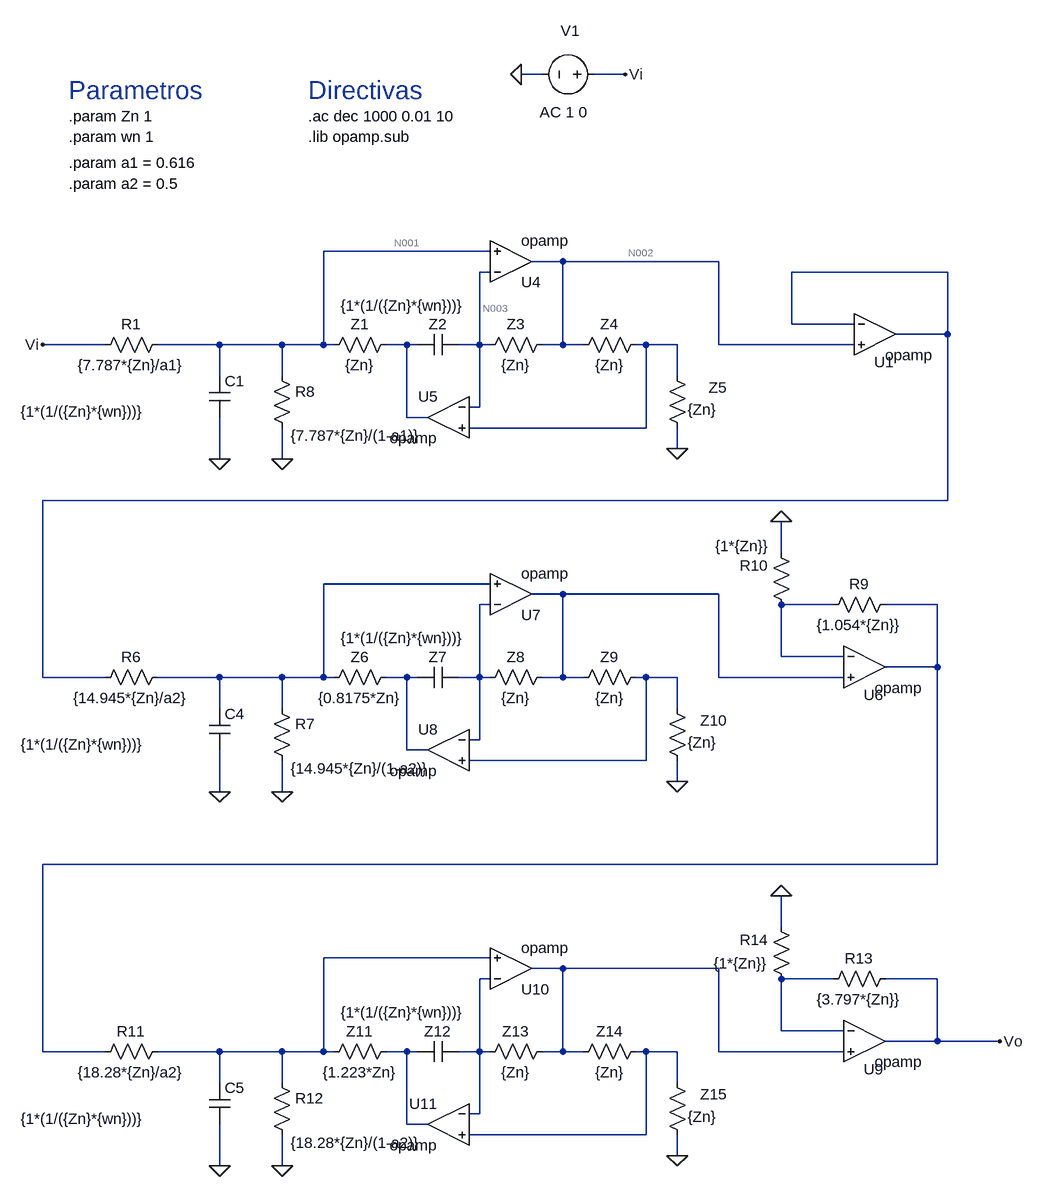
[diagram p0: schematic Circuito_GIC.asc]
Circuito_GIC.asc, the LTspice schematic file:
Version 4
SHEET 1 3280 1412
WIRE -368 -288 -400 -288
WIRE -240 -288 -288 -288
WIRE -448 -16 -704 -16
WIRE -336 0 -384 0
WIRE -96 0 -336 0
WIRE -448 16 -464 16
WIRE 256 16 16 16
WIRE 16 96 16 16
WIRE 112 96 16 96
WIRE 256 112 256 16
WIRE 256 112 176 112
WIRE -1040 128 -1136 128
WIRE -864 128 -960 128
WIRE -768 128 -864 128
WIRE -704 128 -704 -16
WIRE -704 128 -768 128
WIRE -688 128 -704 128
WIRE -576 128 -608 128
WIRE -560 128 -576 128
WIRE -464 128 -464 16
WIRE -464 128 -496 128
WIRE -448 128 -464 128
WIRE -336 128 -336 0
WIRE -336 128 -368 128
WIRE -304 128 -336 128
WIRE -208 128 -224 128
WIRE -160 128 -208 128
WIRE -96 128 -96 0
WIRE 112 128 -96 128
WIRE -864 176 -864 128
WIRE -768 176 -768 128
WIRE -160 176 -160 128
WIRE -464 224 -464 128
WIRE -464 224 -480 224
WIRE -576 240 -576 128
WIRE -544 240 -576 240
WIRE -208 256 -208 128
WIRE -208 256 -480 256
WIRE -160 288 -160 256
WIRE -864 304 -864 240
WIRE -768 304 -768 256
WIRE 256 368 256 112
WIRE 256 368 -1136 368
WIRE 0 448 0 400
WIRE -448 496 -704 496
WIRE -336 512 -384 512
WIRE -96 512 -336 512
WIRE -448 528 -464 528
WIRE 80 528 0 528
WIRE 240 528 160 528
WIRE 0 608 0 528
WIRE 96 608 0 608
WIRE 240 624 240 528
WIRE 240 624 160 624
WIRE -1136 640 -1136 368
WIRE -1040 640 -1136 640
WIRE -864 640 -960 640
WIRE -768 640 -864 640
WIRE -704 640 -704 496
WIRE -704 640 -768 640
WIRE -688 640 -704 640
WIRE -576 640 -608 640
WIRE -560 640 -576 640
WIRE -464 640 -464 528
WIRE -464 640 -496 640
WIRE -448 640 -464 640
WIRE -336 640 -336 512
WIRE -336 640 -368 640
WIRE -304 640 -336 640
WIRE -208 640 -224 640
WIRE -160 640 -208 640
WIRE -96 640 -96 512
WIRE 96 640 -96 640
WIRE -864 688 -864 640
WIRE -768 688 -768 640
WIRE -160 688 -160 640
WIRE -464 736 -464 640
WIRE -464 736 -480 736
WIRE -576 752 -576 640
WIRE -544 752 -576 752
WIRE -208 768 -208 640
WIRE -208 768 -480 768
WIRE -160 800 -160 768
WIRE -864 816 -864 752
WIRE -768 816 -768 768
WIRE 240 928 240 624
WIRE 240 928 -1136 928
WIRE 0 1024 0 976
WIRE -448 1072 -704 1072
WIRE -336 1088 -384 1088
WIRE -96 1088 -336 1088
WIRE -448 1104 -464 1104
WIRE 80 1104 0 1104
WIRE 240 1104 160 1104
WIRE 0 1184 0 1104
WIRE 96 1184 0 1184
WIRE 240 1200 240 1104
WIRE 240 1200 160 1200
WIRE 336 1200 240 1200
WIRE -1136 1216 -1136 928
WIRE -1040 1216 -1136 1216
WIRE -864 1216 -960 1216
WIRE -768 1216 -864 1216
WIRE -704 1216 -704 1072
WIRE -704 1216 -768 1216
WIRE -688 1216 -704 1216
WIRE -576 1216 -608 1216
WIRE -560 1216 -576 1216
WIRE -464 1216 -464 1104
WIRE -464 1216 -496 1216
WIRE -448 1216 -464 1216
WIRE -336 1216 -336 1088
WIRE -336 1216 -368 1216
WIRE -304 1216 -336 1216
WIRE -208 1216 -224 1216
WIRE -160 1216 -208 1216
WIRE -96 1216 -96 1088
WIRE 96 1216 -96 1216
WIRE -864 1264 -864 1216
WIRE -768 1264 -768 1216
WIRE -160 1264 -160 1216
WIRE -464 1312 -464 1216
WIRE -464 1312 -480 1312
WIRE -576 1328 -576 1216
WIRE -544 1328 -576 1328
WIRE -208 1344 -208 1216
WIRE -208 1344 -480 1344
WIRE -160 1376 -160 1344
WIRE -864 1392 -864 1328
WIRE -768 1392 -768 1344
FLAG -864 304 0
FLAG -1136 128 Vi
FLAG -240 -288 Vi
FLAG -400 -288 0
FLAG 336 1200 Vo
FLAG -160 288 0
FLAG -768 304 0
FLAG -864 816 0
FLAG -160 800 0
FLAG -768 816 0
FLAG 0 400 0
FLAG -864 1392 0
FLAG -160 1376 0
FLAG -768 1392 0
FLAG 0 976 0
SYMBOL OpAmps\\opamp 144 48 R0
WINDOW 0 -1 107 Left 2
SYMATTR InstName U1
SYMBOL res -944 112 R90
WINDOW 0 0 56 VBottom 2
WINDOW 3 32 56 VTop 2
SYMATTR InstName R1
SYMATTR Value {7.787*{Zn}/a1}
SYMBOL cap -880 176 R0
WINDOW 3 -290 55 Left 2
SYMATTR Value {1*(1/({Zn}*{wn}))}
SYMATTR InstName C1
SYMBOL voltage -272 -288 R90
WINDOW 123 58 26 VRight 2
WINDOW 39 0 0 Left 0
WINDOW 0 -67 38 VRight 2
SYMATTR Value2 AC 1 0
SYMATTR InstName V1
SYMATTR Value ""
SYMBOL res -592 112 R90
WINDOW 0 0 56 VBottom 2
WINDOW 3 32 56 VTop 2
SYMATTR InstName Z1
SYMATTR Value {Zn}
SYMBOL cap -496 112 R90
WINDOW 0 0 32 VBottom 2
WINDOW 3 -60 85 VTop 2
SYMATTR InstName Z2
SYMATTR Value {1*(1/({Zn}*{wn}))}
SYMBOL res -352 112 R90
WINDOW 0 0 56 VBottom 2
WINDOW 3 32 56 VTop 2
SYMATTR InstName Z3
SYMATTR Value {Zn}
SYMBOL res -208 112 R90
WINDOW 0 0 56 VBottom 2
WINDOW 3 32 56 VTop 2
SYMATTR InstName Z4
SYMATTR Value {Zn}
SYMBOL res -144 272 R180
WINDOW 0 -61 78 Left 2
WINDOW 3 -45 44 Left 2
SYMATTR InstName Z5
SYMATTR Value {Zn}
SYMBOL OpAmps\\opamp -416 64 M180
SYMATTR InstName U4
SYMBOL OpAmps\\opamp -512 176 M0
SYMATTR InstName U5
SYMBOL res -784 160 R0
WINDOW 3 29 108 Left 2
SYMATTR Value {7.787*{Zn}/(1-a1)}
SYMATTR InstName R8
SYMBOL OpAmps\\opamp 128 560 R0
WINDOW 0 -1 107 Left 2
SYMATTR InstName U6
SYMBOL res -944 624 R90
WINDOW 0 0 56 VBottom 2
WINDOW 3 32 56 VTop 2
SYMATTR InstName R6
SYMATTR Value {14.945*{Zn}/a2}
SYMBOL cap -880 688 R0
WINDOW 3 -290 55 Left 2
SYMATTR Value {1*(1/({Zn}*{wn}))}
SYMATTR InstName C4
SYMBOL res -592 624 R90
WINDOW 0 0 56 VBottom 2
WINDOW 3 32 56 VTop 2
SYMATTR InstName Z6
SYMATTR Value {0.8175*Zn}
SYMBOL cap -496 624 R90
WINDOW 0 0 32 VBottom 2
WINDOW 3 -60 85 VTop 2
SYMATTR InstName Z7
SYMATTR Value {1*(1/({Zn}*{wn}))}
SYMBOL res -352 624 R90
WINDOW 0 0 56 VBottom 2
WINDOW 3 32 56 VTop 2
SYMATTR InstName Z8
SYMATTR Value {Zn}
SYMBOL res -208 624 R90
WINDOW 0 0 56 VBottom 2
WINDOW 3 32 56 VTop 2
SYMATTR InstName Z9
SYMATTR Value {Zn}
SYMBOL res -144 784 R180
WINDOW 0 -61 78 Left 2
WINDOW 3 -45 44 Left 2
SYMATTR InstName Z10
SYMATTR Value {Zn}
SYMBOL OpAmps\\opamp -416 576 M180
SYMATTR InstName U7
SYMBOL OpAmps\\opamp -512 688 M0
SYMATTR InstName U8
SYMBOL res -784 672 R0
WINDOW 3 29 108 Left 2
SYMATTR Value {14.945*{Zn}/(1-a2)}
SYMATTR InstName R7
SYMBOL res 176 512 R90
WINDOW 0 0 56 VBottom 2
WINDOW 3 32 56 VTop 2
SYMATTR InstName R9
SYMATTR Value {1.054*{Zn}}
SYMBOL res 16 544 R180
WINDOW 0 36 76 Left 2
WINDOW 3 34 106 Left 2
SYMATTR InstName R10
SYMATTR Value {1*{Zn}}
SYMBOL OpAmps\\opamp 128 1136 R0
WINDOW 0 -1 107 Left 2
SYMATTR InstName U9
SYMBOL res -944 1200 R90
WINDOW 0 0 56 VBottom 2
WINDOW 3 32 56 VTop 2
SYMATTR InstName R11
SYMATTR Value {18.28*{Zn}/a2}
SYMBOL cap -880 1264 R0
WINDOW 3 -290 55 Left 2
SYMATTR Value {1*(1/({Zn}*{wn}))}
SYMATTR InstName C5
SYMBOL res -592 1200 R90
WINDOW 0 0 56 VBottom 2
WINDOW 3 32 56 VTop 2
SYMATTR InstName Z11
SYMATTR Value {1.223*Zn}
SYMBOL cap -496 1200 R90
WINDOW 0 0 32 VBottom 2
WINDOW 3 -60 85 VTop 2
SYMATTR InstName Z12
SYMATTR Value {1*(1/({Zn}*{wn}))}
SYMBOL res -352 1200 R90
WINDOW 0 0 56 VBottom 2
WINDOW 3 32 56 VTop 2
SYMATTR InstName Z13
SYMATTR Value {Zn}
SYMBOL res -208 1200 R90
WINDOW 0 0 56 VBottom 2
WINDOW 3 32 56 VTop 2
SYMATTR InstName Z14
SYMATTR Value {Zn}
SYMBOL res -144 1360 R180
WINDOW 0 -61 78 Left 2
WINDOW 3 -45 44 Left 2
SYMATTR InstName Z15
SYMATTR Value {Zn}
SYMBOL OpAmps\\opamp -416 1152 M180
SYMATTR InstName U10
SYMBOL OpAmps\\opamp -512 1264 M0
SYMATTR InstName U11
SYMBOL res -784 1248 R0
WINDOW 3 29 108 Left 2
SYMATTR Value {18.28*{Zn}/(1-a2)}
SYMATTR InstName R12
SYMBOL res 176 1088 R90
WINDOW 0 0 56 VBottom 2
WINDOW 3 32 56 VTop 2
SYMATTR InstName R13
SYMATTR Value {3.797*{Zn}}
SYMBOL res 16 1120 R180
WINDOW 0 36 76 Left 2
WINDOW 3 36 40 Left 2
SYMATTR InstName R14
SYMATTR Value {1*{Zn}}
TEXT -728 -192 Left 2 !.lib opamp.sub
TEXT -1096 -224 Left 2 !.param Zn 1
TEXT -1096 -192 Left 2 !.param wn 1
TEXT -728 -224 Left 2 !.ac dec 1000 0.01 10
TEXT -1096 -264 Left 4 ;Parametros
TEXT -728 -264 Left 4 ;Directivas
TEXT -1096 -152 Left 2 !.param a1 = 0.616
TEXT -1096 -120 Left 2 !.param a2 = 0.5

The netlist it stands for:
* Circuito_GIC.asc
XU1 N004 N002 N004 opamp Aol=100K GBW=10Meg  ; pins invin noninvin out
R1 N001 Vi {7.787*{Zn}/a1}
C1 N001 0 {1*(1/({Zn}*{wn}))}
V1 Vi 0 AC 1 0
R§Z1 N005 N001 {Zn}
C§Z2 N003 N005 {1*(1/({Zn}*{wn}))}
R§Z3 N002 N003 {Zn}
R§Z4 N006 N002 {Zn}
R§Z5 0 N006 {Zn}
XU4 N003 N001 N002 opamp Aol=100K GBW=10Meg  ; pins invin noninvin out
XU5 N003 N006 N005 opamp Aol=100K GBW=10Meg  ; pins invin noninvin out
R8 N001 0 {7.787*{Zn}/(1-a1)}
XU6 N010 N008 N011 opamp Aol=100K GBW=10Meg  ; pins invin noninvin out
R6 N007 N004 {14.945*{Zn}/a2}
C4 N007 0 {1*(1/({Zn}*{wn}))}
R§Z6 N012 N007 {0.8175*Zn}
C§Z7 N009 N012 {1*(1/({Zn}*{wn}))}
R§Z8 N008 N009 {Zn}
R§Z9 N013 N008 {Zn}
R§Z10 0 N013 {Zn}
XU7 N009 N007 N008 opamp Aol=100K GBW=10Meg  ; pins invin noninvin out
XU8 N009 N013 N012 opamp Aol=100K GBW=10Meg  ; pins invin noninvin out
R7 N007 0 {14.945*{Zn}/(1-a2)}
R9 N011 N010 {1.054*{Zn}}
R10 N010 0 {1*{Zn}}
XU9 N017 N015 Vo opamp Aol=100K GBW=10Meg  ; pins invin noninvin out
R11 N014 N011 {18.28*{Zn}/a2}
C5 N014 0 {1*(1/({Zn}*{wn}))}
R§Z11 N018 N014 {1.223*Zn}
C§Z12 N016 N018 {1*(1/({Zn}*{wn}))}
R§Z13 N015 N016 {Zn}
R§Z14 N019 N015 {Zn}
R§Z15 0 N019 {Zn}
XU10 N016 N014 N015 opamp Aol=100K GBW=10Meg  ; pins invin noninvin out
XU11 N016 N019 N018 opamp Aol=100K GBW=10Meg  ; pins invin noninvin out
R12 N014 0 {18.28*{Zn}/(1-a2)}
R13 Vo N017 {3.797*{Zn}}
R14 N017 0 {1*{Zn}}
.lib opamp.sub
.param Zn 1
.param wn 1
.ac dec 1000 0.01 10
* Parametros
* Directivas
.param a1 = 0.616
.param a2 = 0.5
.backanno
.end

* Results of the author's LTspice run, read from the files saved beside the schematic
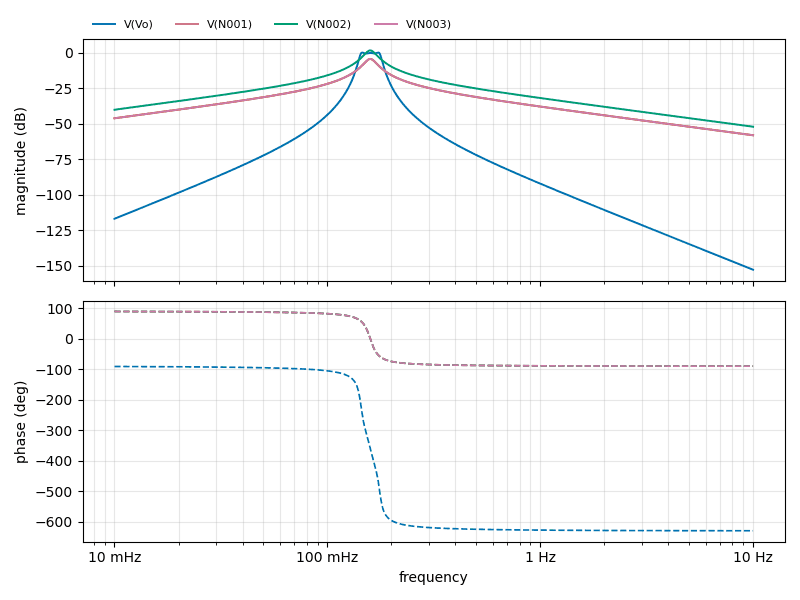
[diagram p1: AC Analysis of Circuito_GIC.asc, plotted from the saved traces]
* AC Analysis, 1 run:
*   V(Vo): -116.88 dB at 10 mHz, -152.76 dB at 10 Hz, peak 0.31 dB at 145.9 mHz, 3 dB below the peak at 141.9 mHz and 178.6 mHz
*   V(N001): -46.04 dB at 10 mHz, -58.00 dB at 10 Hz, peak -4.21 dB at 159.2 mHz, 3 dB below the peak at 149.3 mHz and 169.7 mHz
*   V(N002): -40.02 dB at 10 mHz, -51.98 dB at 10 Hz, peak 1.81 dB at 159.2 mHz, 3 dB below the peak at 149.3 mHz and 169.7 mHz
*   V(N003): -46.04 dB at 10 mHz, -58.00 dB at 10 Hz, peak -4.21 dB at 159.2 mHz, 3 dB below the peak at 149.3 mHz and 169.7 mHz